# Altium schematic sheet STM32_USB四麦阵列.schdoc
size 312 x 207 mm
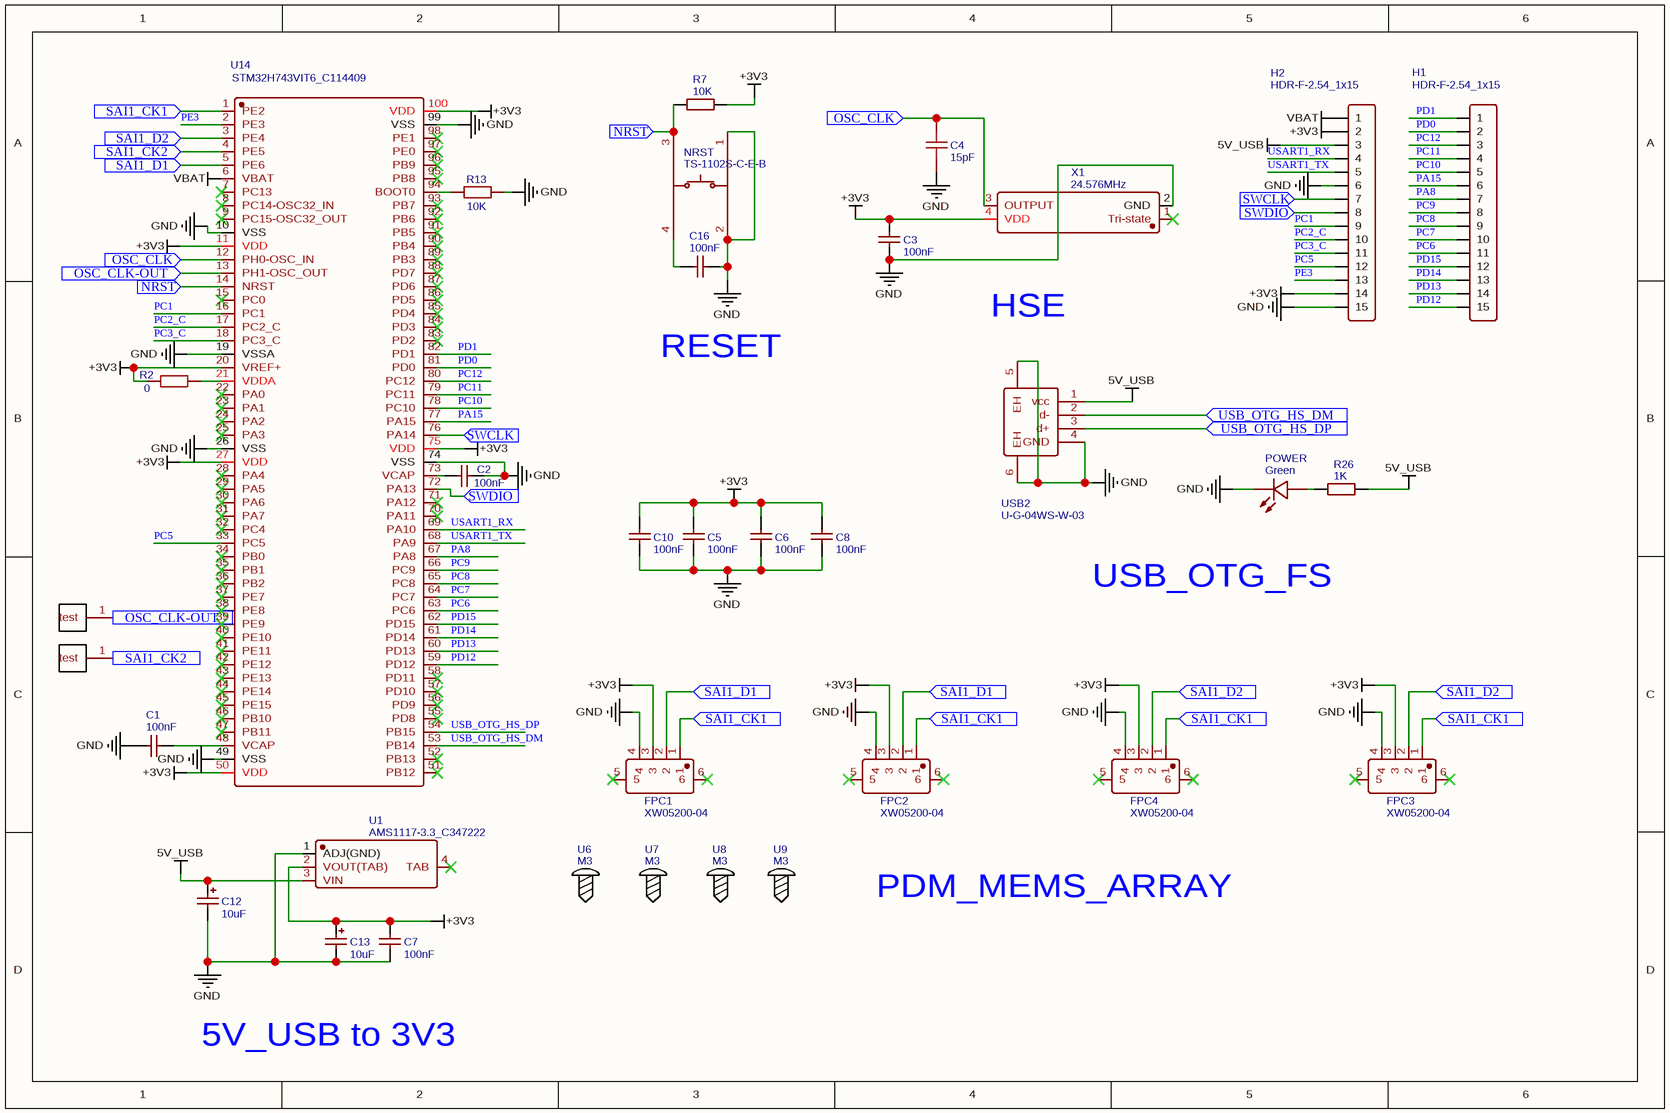
[diagram p0: STM32_USB四麦阵列.schdoc]

## Parts
C1  100nF  [C0805]
C2  100nF  [C0805]
C3  100nF  [C0805]
C4  15pF  [C0805]
C5  100nF  [C0805]
C6  100nF  [C0805]
C7  100nF  [C0805]
C8  100nF  [C0805]
C10  100nF  [C0805]
C12  10uF  [CAP-SMD_L3.2-W1.6]
C13  10uF  [CAP-SMD_L3.2-W1.6]
C16  100nF  [C0805]
FPC1  XW05200-04  [FPC-SMD_4P-P0.50_XW05200-04]
FPC2  XW05200-04  [FPC-SMD_4P-P0.50_XW05200-04]
FPC3  XW05200-04  [FPC-SMD_4P-P0.50_XW05200-04]
FPC4  XW05200-04  [FPC-SMD_4P-P0.50_XW05200-04]
H1  HDR-F-2.54_1x15  [HDR-F-2.54_1X15]
H2  HDR-F-2.54_1x15  [HDR-F-2.54_1X15]
NRST  TS-1102S-C-E-B  [KEY-SMD_4P-L6.0-W6.0-P4.50-LS8.6]
POWER  Green  [LED0805-FD]
R2  0  [R0805]
R7  10K  [R0805]
R13  10K  [R0805]
R26  1K  [R0805]
U1  AMS1117-3.3_C347222  [SOT-223_L6.7-W3.5-P2.30-BR]
U2  test  [TEST]  (value not drawn)
U4  test  [TEST]  (value not drawn)
U6  M3  [M3-3]
U7  M3  [M3-3]
U8  M3  [M3-3]
U9  M3  [M3-3]
U14  STM32H743VIT6_C114409  [LQFP-100_L14.0-W14.0-P0.50-LS16.0-BL]
USB2  U-G-04WS-W-03  [USB-A-SMD_U-G-04WS-W-03]
X1  24.576MHz  [OSC-SMD_4P-L5.0-W3.2-BL_SG5032]

## Ports
NRST (in), OSC_CLK (in), OSC_CLK-OUT (in), SAI1_CK1 (in), SAI1_CK2 (in), SAI1_D1 (in), SAI1_D2 (in), SWCLK (in), SWDIO (in), USB_OTG_HS_DM (in), USB_OTG_HS_DP (in)

## Nets
5V_USB: C12.1 H2.3 R26.2 U1.3(VIN) USB2.1(vcc)
+3V3: C3.2 C5.2 C6.2 C7.2 C8.2 C10.2 C13.1 FPC1.3 FPC2.3 FPC3.3 FPC4.3 H2.2 H2.14 R2.1 R7.1 U1.2(VOUT(TAB)) U14.11(VDD) U14.20(VREF+) U14.27(VDD) U14.50(VDD) U14.75(VDD) U14.100(VDD) X1.4(VDD)
GND: C1.1 C2.1 C3.1 C4.1 C5.1 C6.1 C7.1 C8.1 C10.1 C12.2 C13.2 C16.1 FPC1.4 FPC2.4 FPC3.4 FPC4.4 H2.6 H2.15 NRST.1 NRST.2 POWER.2(K) R13.1 U1.1(ADJ(GND)) U14.10(VSS) U14.19(VSSA) U14.26(VSS) U14.49(VSS) U14.74(VSS) U14.99(VSS) USB2.4(GND) USB2.5(EH) USB2.6(EH) X1.2(GND)
VBAT: H2.1 U14.6(VBAT)
NRST: NRST.3 R7.2 U14.14(NRST) ; port NRST
OSC_CLK: C4.2 U14.12(PH0-OSC_IN) X1.3(OUTPUT) ; port OSC_CLK
OSC_CLK-OUT: U2.1(test) U14.13(PH1-OSC_OUT) ; port OSC_CLK-OUT
PA8: H1.7 U14.67(PA8)
PA15: H1.6 U14.77(PA15)
PC1: H2.9 U14.16(PC1)
PC2_C: H2.10 U14.17(PC2_C)
PC3_C: H2.11 U14.18(PC3_C)
PC5: H2.12 U14.33(PC5)
PC6: H1.11 U14.63(PC6)
PC7: H1.10 U14.64(PC7)
PC8: H1.9 U14.65(PC8)
PC9: H1.8 U14.66(PC9)
PC10: H1.5 U14.78(PC10)
PC11: H1.4 U14.79(PC11)
PC12: H1.3 U14.80(PC12)
PD0: H1.2 U14.81(PD0)
PD1: H1.1 U14.82(PD1)
PD12: H1.15 U14.59(PD12)
PD13: H1.14 U14.60(PD13)
PD14: H1.13 U14.61(PD14)
PD15: H1.12 U14.62(PD15)
PE3: H2.13 U14.2(PE3)
SAI1_CK1: FPC1.1 FPC2.1 FPC3.1 FPC4.1 U14.1(PE2) ; port SAI1_CK1
SAI1_CK2: U4.1(test) U14.4(PE5) ; port SAI1_CK2
SAI1_D1: FPC1.2 FPC2.2 U14.5(PE6) ; port SAI1_D1
SAI1_D2: FPC3.2 FPC4.2 U14.3(PE4) ; port SAI1_D2
SWCLK: H2.7 U14.76(PA14) ; port SWCLK
SWDIO: H2.8 U14.72(PA13) ; port SWDIO
USART1_RX: H2.4 U14.69(PA10)
USART1_TX: H2.5 U14.68(PA9)
USB_OTG_HS_DM: U14.53(PB14)
USB_OTG_HS_DM: USB2.2(d-) ; port USB_OTG_HS_DM  [a separate net that carries the same name]
USB_OTG_HS_DP: U14.54(PB15)
USB_OTG_HS_DP: USB2.3(d+) ; port USB_OTG_HS_DP  [a separate net that carries the same name]
NetC1_2: C1.2 U14.48(VCAP)
NetC2_2: C2.2 U14.73(VCAP)
NetC16_2: C16.2 NRST.4
NetPOWER_1: POWER.1(A) R26.1
NetR2_2: R2.2 U14.21(VDDA)
NetR13_2: R13.2 U14.94(BOOT0)

Not connected (* = marked no-connect by the designer): FPC1 5* 6*; FPC2 5* 6*; FPC3 5* 6*; FPC4 5* 6*; U1 4(TAB)*; U14 7(PC13)* 8(PC14-OSC32_IN)* 9(PC15-OSC32_OUT)* 15(PC0)* 22(PA0)* 23(PA1)* 24(PA2)* 25(PA3)* 28(PA4)* 29(PA5)* 30(PA6)* 31(PA7)* 32(PC4)* 34(PB0)* 35(PB1)* 36(PB2)* 37(PE7)* 38(PE8)* 39(PE9)* 40(PE10)* 41(PE11)* 42(PE12)* 43(PE13)* 44(PE14)* 45(PE15)* 46(PB10)* 47(PB11)* 51(PB12)* 52(PB13)* 55(PD8)* 56(PD9)* 57(PD10)* 58(PD11)* 70(PA11)* 71(PA12)* 83(PD2)* 84(PD3)* 85(PD4)* 86(PD5)* 87(PD6)* 88(PD7)* 89(PB3)* 90(PB4)* 91(PB5)* 92(PB6)* 93(PB7)* 95(PB8)* 96(PB9)* 97(PE0)* 98(PE1)*; X1 1(Tri-state)*

## Notes on the sheet
- HSE
- RESET
- USB_OTG_FS
- PDM_MEMS_ARRAY
- 5V_USB to 3V3

## Library data of the parts
C1-C3 C5-C8 C10 C16 = 100nF: BOM_Manufacturer: YAGEO; BOM_Manufacturer Part: CC0805JRX7R9BB104; nameAlias: Capacitance; BOM_Supplier: LCSC; BOM_Supplier Part: C111492; spicePre: C; spiceSymbolName: CC0805JRX7R9BB104
C4 = 15pF: BOM_Manufacturer: YAGEO; BOM_Manufacturer Part: CC0805FRNPO9BN150; nameAlias: Capacitance; Contributor: LCSC; BOM_Supplier: LCSC; BOM_Supplier Part: C527077; spicePre: C; spiceSymbolName: CC0805FRNPO9BN150
C12 C13 = 10uF: BOM_Manufacturer: Xiangyee; BOM_Manufacturer Part: CA45-A010K106T; nameAlias: Capacitance; SMT Type: Extend; BOM_Supplier: LCSC; BOM_Supplier Part: C119052; BOM_LCSC Assembly: Yes; spicePre: C; spiceSymbolName: CA45-A010K106T
FPC1-FPC4 = XW05200-04: BOM_Manufacturer: MINTRON; Contributor: LCSC; BOM_Supplier: LCSC; BOM_Supplier Part: C376056; BOM_Manufacturer Part: XW05200-04; JLCPCB Part Class: Extended Part; spicePre: F; spiceSymbolName: XW05200-04
H1 H2 = HDR-F-2.54_1x15: Contributor: LCEDA_Lib; BOM_Supplier Part: C124408; BOM_Supplier: LCSC; spicePre: H; spiceSymbolName: HDR-F-2.54_1x15
NRST = TS-1102S-C-E-B: BOM_Manufacturer: XKB Enterprise; Contributor: LCSC; BOM_Supplier: LCSC; BOM_Supplier Part: C381042; BOM_Manufacturer Part: TS-1102S-C-E-B; spicePre: S; spiceSymbolName: TS-1102S-C-E-B
POWER = Green: BOM_Manufacturer: NATIONSTAR; BOM_Manufacturer Part: FC-2012UGK-520D5; SMT Type: Extend; BOM_Supplier: LCSC; BOM_Supplier Part: C84260; BOM_LCSC Assembly: Yes; spicePre: L; spiceSymbolName: FC-2012UGK-520D5
R2 = 0: BOM_Manufacturer: Guangdong Fenghua Advanced Tech; BOM_Manufacturer Part: RS-05000FT; nameAlias: Resistance (Ohms); Contributor: LCSC; BOM_Supplier: LCSC; BOM_Supplier Part: C132364; spicePre: R; spiceSymbolName: RS-05000FT
R7 = 10K: BOM_Manufacturer: FH; BOM_Manufacturer Part: RS-05K1002FT; nameAlias: Resistance (Ohms); BOM_Supplier: LCSC; BOM_Supplier Part: C115309; spicePre: R; spiceSymbolName: RS-05K1002FT
R13 = 10K: BOM_Manufacturer: Uniroyal Elec; BOM_Manufacturer Part: 0805W8F1003T5E; nameAlias: Resistance (Ohms); Contributor: LCSC; BOM_Supplier: LCSC; BOM_Supplier Part: C149504; spicePre: R; spiceSymbolName: 0805W8F1003T5E_C149504
R26 = 1K: BOM_Manufacturer: UniOhm; BOM_Manufacturer Part: 0805W8J0102T5E; nameAlias: Resistance (Ohms); BOM_Supplier: LCSC; BOM_Supplier Part: C25623; spicePre: R; spiceSymbolName: 0805W8J0102T5E
U1 = AMS1117-3.3_C347222: BOM_Manufacturer: Youtai Semiconductor Co., Ltd.; Contributor: LCSC; BOM_Supplier: LCSC; BOM_Supplier Part: C347222; BOM_Manufacturer Part: AMS1117-3.3; BOM_JLCPCB Part Class: Extended Part; JLCPCB Part Class: Extended Part; spicePre: U; spiceSymbolName: AMS1117-3.3_C347222
U2 U4 = test: Contributor: Ssu7828; spicePre: U; spiceSymbolName: test
U6-U9 = M3: Contributor: ww22350777; spicePre: U; spiceSymbolName: M3
U14 = STM32H743VIT6_C114409: BOM_Manufacturer: STMicroelectronics; Contributor: LCSC; BOM_Supplier: LCSC; BOM_Supplier Part: C114409; BOM_Manufacturer Part: STM32H743VIT6; spicePre: U; spiceSymbolName: STM32H743VIT6_C114409
USB2 = U-G-04WS-W-03: BOM_Manufacturer: 韩国韩荣; Contributor: LCSC; BOM_Supplier: LCSC; BOM_Supplier Part: C283548; BOM_Manufacturer Part: U-G-04WS-W-03; spicePre: U; spiceSymbolName: U-G-04WS-W-03
X1 = 24.576MHz: BOM_Manufacturer: Shenzhen SCTF Elec; BOM_Manufacturer Part: S5D24.576000B20F30T; nameAlias: Frequency; Contributor: LCSC; BOM_Supplier: LCSC; BOM_Supplier Part: C387253; spicePre: X; spiceSymbolName: S5D24.576000B20F30T